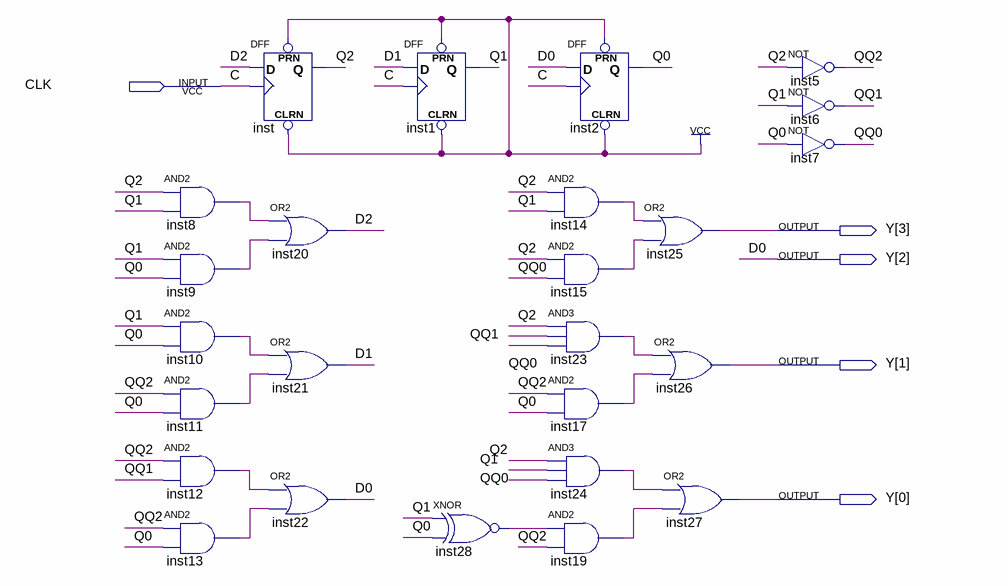
[diagram p0: schematic sheet]
// Quartus schematic fivetoten.bdf as structural Verilog: 25 symbols, 5 pins
module fivetoten (
  input  CLK,
  output [3:0] Y
);

  wire D1, D2, inst8_out, inst9_out, inst10_out, inst11_out, inst12_out, inst13_out, inst14_out, inst15_out,
       inst17_out, inst19_out, inst23_out, inst24_out, inst28_out, Q0, Q1, Q2, QQ0, QQ1, QQ2;

  and inst8 (inst8_out, Q2, Q1);
  and inst9 (inst9_out, Q1, Q0);
  and inst10 (inst10_out, Q1, Q0);
  and inst11 (inst11_out, QQ2, Q0);
  and inst12 (inst12_out, QQ2, QQ1);
  and inst13 (inst13_out, QQ2, Q0);
  DFF inst (.CLRN(1'b1), .CLK(CLK), .D(D2), .PRN(1'b1), .Q(Q2));
  or inst20 (D2, inst8_out, inst9_out);
  or inst21 (D1, inst10_out, inst11_out);
  or inst22 (Y[2], inst12_out, inst13_out);
  DFF inst1 (.CLRN(1'b1), .CLK(CLK), .D(D1), .PRN(1'b1), .Q(Q1));
  xnor inst28 (inst28_out, Q1, Q0);
  DFF inst2 (.CLRN(1'b1), .CLK(CLK), .D(Y[2]), .PRN(1'b1), .Q(Q0));
  and inst14 (inst14_out, Q2, Q1);
  and inst15 (inst15_out, Q2, QQ0);
  and inst23 (inst23_out, Q2, QQ1, QQ0);
  and inst17 (inst17_out, QQ2, Q0);
  and inst24 (inst24_out, Q2, Q1, QQ0);
  and inst19 (inst19_out, inst28_out, QQ2);
  or inst25 (Y[3], inst14_out, inst15_out);
  or inst26 (Y[1], inst23_out, inst17_out);
  or inst27 (Y[0], inst24_out, inst19_out);
  not inst5 (QQ2, Q2);
  not inst6 (QQ1, Q1);
  not inst7 (QQ0, Q0);

  // Other names for the same wires on the sheet: C = CLK; D0 = Y[2]
endmodule
